# Altium schematic sheet 2016_Carte_Mosfet.SchDoc
size A4
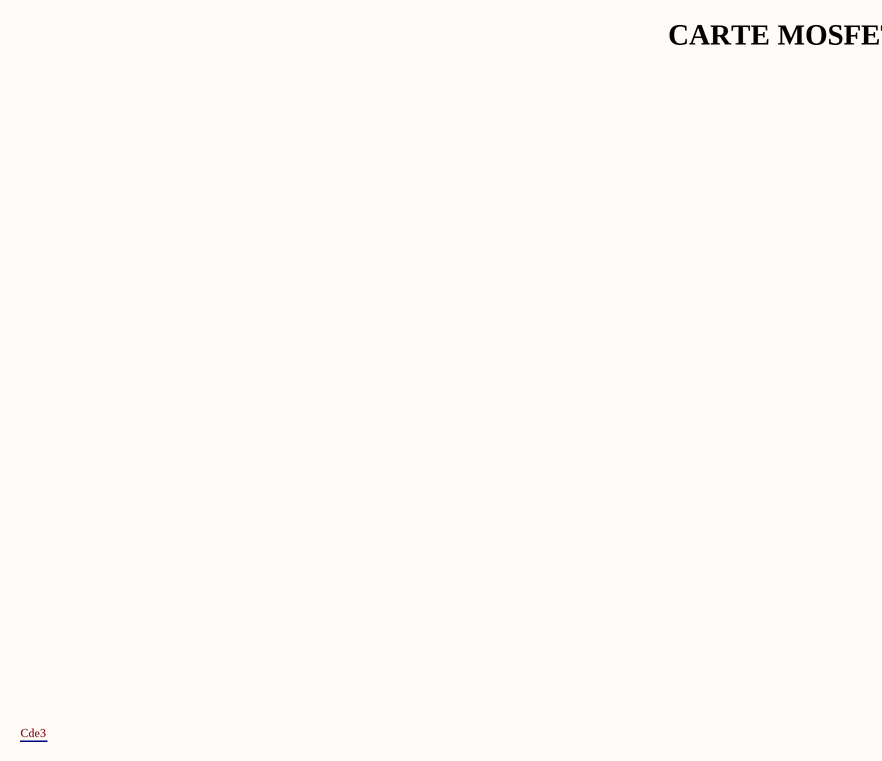
[diagram p0: 2016_Carte_Mosfet.SchDoc]

## Notes on the sheet
- CARTE MOSFET